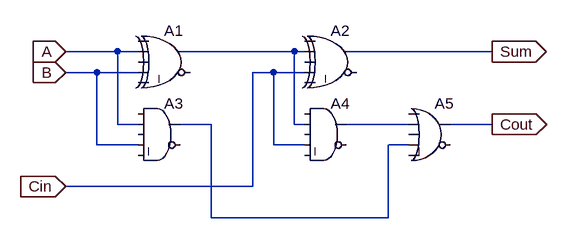
[diagram p0: schematic full-adder.asc]
full-adder.asc, the LTspice schematic file:
Version 4
SHEET 1 880 680
WIRE 48 80 -32 80
WIRE 80 80 48 80
WIRE 320 80 144 80
WIRE 336 80 320 80
WIRE 624 80 400 80
WIRE 16 112 -32 112
WIRE 80 112 16 112
WIRE 288 112 256 112
WIRE 336 112 288 112
WIRE 48 192 48 80
WIRE 80 192 48 192
WIRE 192 192 144 192
WIRE 320 192 320 80
WIRE 336 192 320 192
WIRE 496 192 400 192
WIRE 624 192 560 192
WIRE 16 224 16 112
WIRE 80 224 16 224
WIRE 288 224 288 112
WIRE 336 224 288 224
WIRE 496 224 464 224
WIRE 256 288 256 112
WIRE 256 288 -32 288
WIRE 192 336 192 192
WIRE 464 336 464 224
WIRE 464 336 192 336
FLAG -32 80 A
IOPIN -32 80 In
FLAG -32 112 B
IOPIN -32 112 In
FLAG -32 288 Cin
IOPIN -32 288 In
FLAG 624 80 Sum
IOPIN 624 80 Out
FLAG 624 192 Cout
IOPIN 624 192 Out
SYMBOL Digital\\xor 128 32 R0
SYMATTR InstName A1
SYMBOL Digital\\xor 384 32 R0
SYMATTR InstName A2
SYMBOL Digital\\and 112 144 R0
SYMATTR InstName A3
SYMBOL Digital\\and 368 144 R0
SYMATTR InstName A4
SYMBOL Digital\\or 528 144 R0
SYMATTR InstName A5

The netlist it stands for:
* full-adder.asc
A1 0 A 0 B 0 0 N001 0 XOR
A2 0 N001 0 Cin 0 0 Sum 0 XOR
A3 0 A 0 B 0 0 N002 0 AND
A4 0 N001 0 Cin 0 0 N003 0 AND
A5 0 N003 0 N002 0 0 Cout 0 OR
.backanno
.end